# Altium schematic sheet Dial.SchDoc
size A4; SheetNumber: 7; SheetTotal: 8
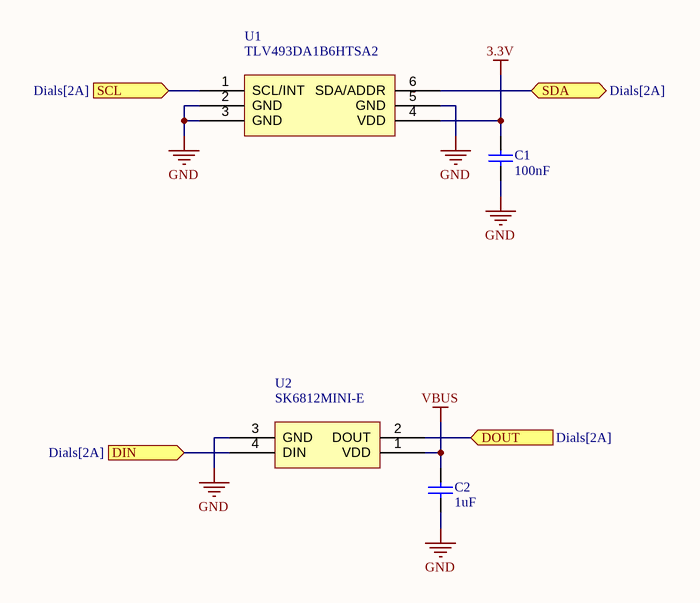
[diagram p0: Dial.SchDoc]

## Parts
C1  100nF  [Capacitor 0603]
C2  1uF  [Capacitor 0603]
U1  TLV493DA1B6HTSA2  [SOT-23-6]
U2  SK6812MINI-E  [SK6812MINI-E]

## Ports
DIN (in, see Dials[2A]), DOUT (in, see Dials[2A]), SCL (in, see Dials[2A]), SDA (bidir, see Dials[2A])

## Nets
3.3V: C1.2 U1.4(VDD)
GND: C1.1 C2.1 U1.2(GND) U1.3(GND) U1.5(GND) U2.3(GND)
VBUS: C2.2 U2.1(VDD)
DIN: U2.4(DIN) ; port DIN
DOUT: U2.2(DOUT) ; port DOUT
SCL: U1.1(SCL/INT) ; port SCL
SDA: U1.6(SDA/ADDR) ; port SDA

## Notes on the sheet
- TITLE
- SIZE
- A4
- VARIANT
- PROJECT
- SHEET
- VERSION
- OF
- AUTHOR
- DATE

## Library data of the parts
C1 C2 = Capacitor